# Altium schematic sheet 2_keys.SchDoc (part 2 of 2)
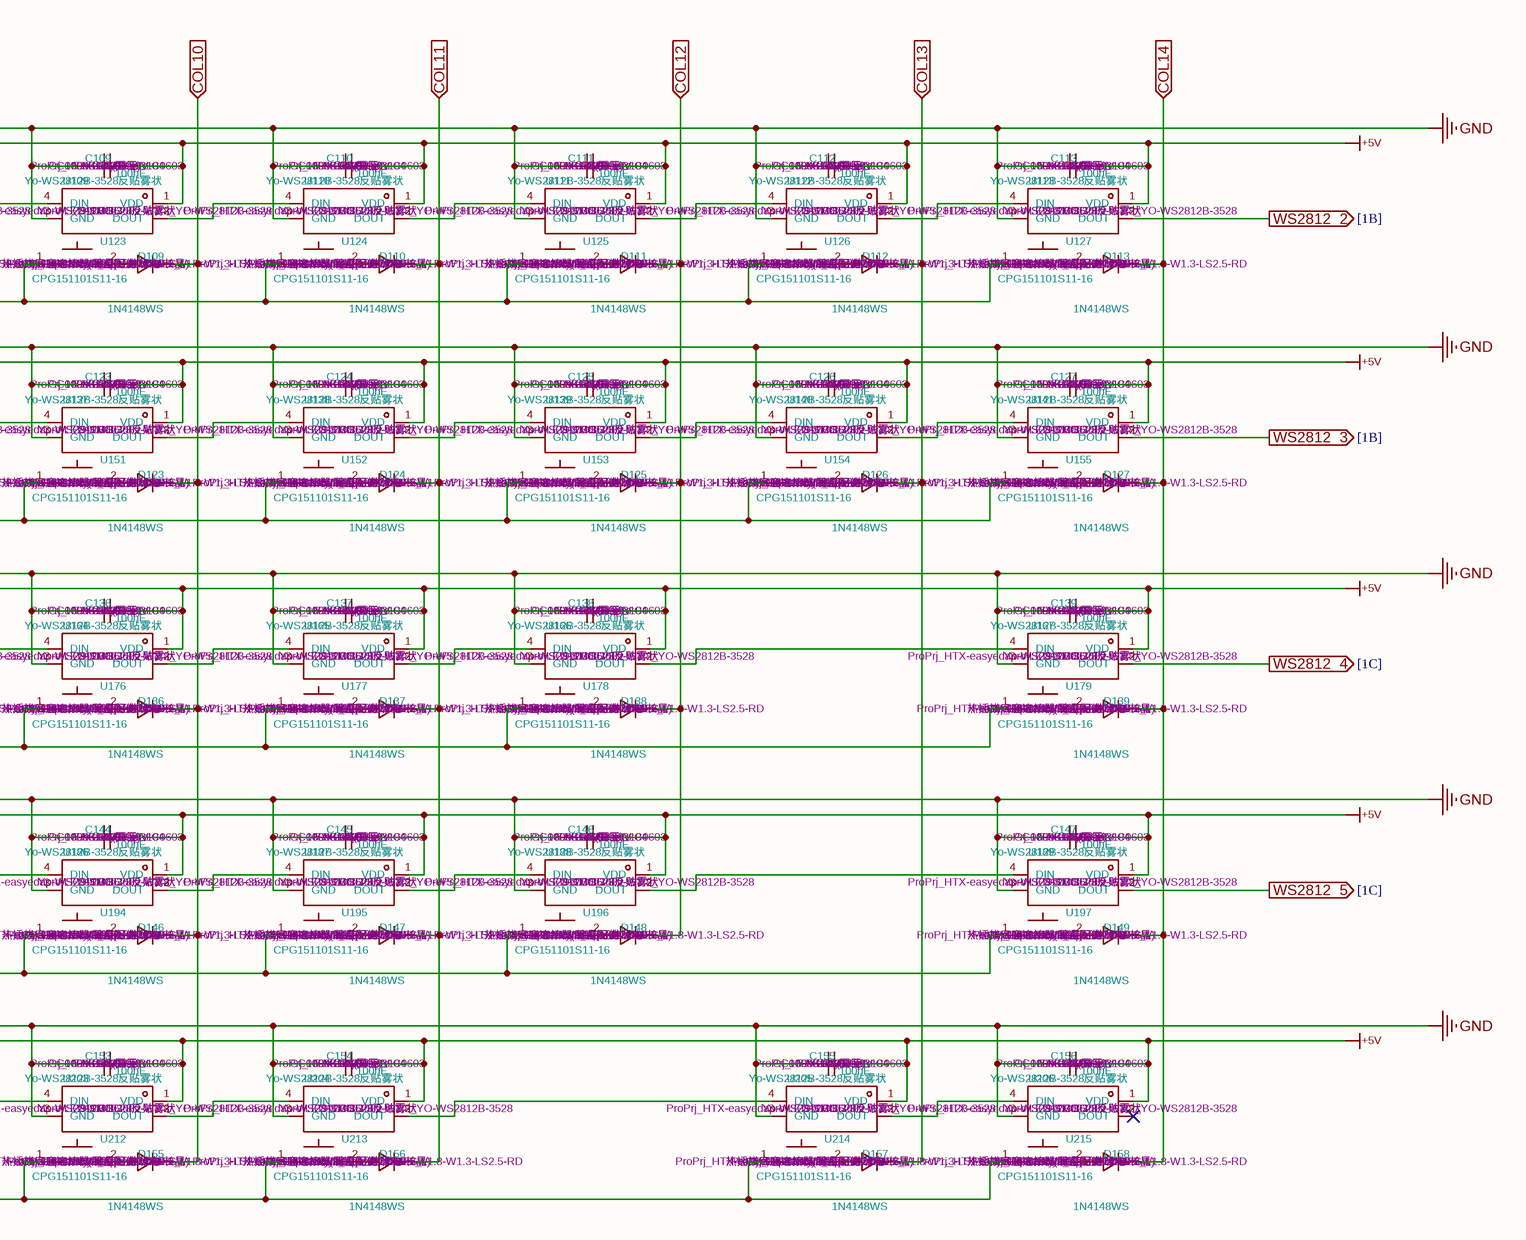
[diagram p3: 2_keys.SchDoc, right]

## Nets
+5V: C100.2 C101.2 C102.2 C103.2 C104.2 C105.2 C106.2 C107.2 C108.2 C109.2 C110.2 C111.2 C112.2 C113.2 C114.2 C115.2 C116.2 C117.2 C118.2 C119.2 C120.2 C121.2 C122.2 C123.2 C124.2 C125.2 C126.2 C127.2 C128.2 C129.2 C130.2 C131.2 C132.2 C133.2 C134.2 C135.2 C136.2 C137.2 C138.2 C139.2 C140.2 C141.2 C142.2 C143.2 C144.2 C145.2 C146.2 C147.2 C148.2 C149.2 C150.2 C151.2 C152.2 C153.2 C154.2 C155.2 C156.2 U100.1(VDD) U101.1(VDD) U102.1(VDD) U103.1(VDD) U104.1(VDD) U105.1(VDD) U106.1(VDD) U107.1(VDD) U108.1(VDD) U109.1(VDD) U110.1(VDD) U111.1(VDD) U112.1(VDD) U113.1(VDD) U128.1(VDD) U129.1(VDD) U130.1(VDD) U131.1(VDD) U132.1(VDD) U133.1(VDD) U134.1(VDD) U135.1(VDD) U136.1(VDD) U137.1(VDD) U138.1(VDD) U139.1(VDD) U140.1(VDD) U141.1(VDD) U156.1(VDD) U157.1(VDD) U158.1(VDD) U159.1(VDD) U160.1(VDD) U161.1(VDD) U162.1(VDD) U163.1(VDD) U164.1(VDD) U165.1(VDD) U166.1(VDD) U167.1(VDD) U180.3(VDD) U181.3(VDD) U182.1(VDD) U183.1(VDD) U184.1(VDD) U185.1(VDD) U186.1(VDD) U187.1(VDD) U188.1(VDD) U189.1(VDD) U198.1(VDD) U199.1(VDD) U200.1(VDD) U201.1(VDD) U202.1(VDD) U203.1(VDD) U204.1(VDD) U205.1(VDD) U206.1(VDD)
GND: C100.1 C101.1 C102.1 C103.1 C104.1 C105.1 C106.1 C107.1 C108.1 C109.1 C110.1 C111.1 C112.1 C113.1 C114.1 C115.1 C116.1 C117.1 C118.1 C119.1 C120.1 C121.1 C122.1 C123.1 C124.1 C125.1 C126.1 C127.1 C128.1 C129.1 C130.1 C131.1 C132.1 C133.1 C134.1 C135.1 C136.1 C137.1 C138.1 C139.1 C140.1 C141.1 C142.1 C143.1 C144.1 C145.1 C146.1 C147.1 C148.1 C149.1 C150.1 C151.1 C152.1 C153.1 C154.1 C155.1 C156.1 U100.3(GND) U101.3(GND) U102.3(GND) U103.3(GND) U104.3(GND) U105.3(GND) U106.3(GND) U107.3(GND) U108.3(GND) U109.3(GND) U110.3(GND) U111.3(GND) U112.3(GND) U113.3(GND) U128.3(GND) U129.3(GND) U130.3(GND) U131.3(GND) U132.3(GND) U133.3(GND) U134.3(GND) U135.3(GND) U136.3(GND) U137.3(GND) U138.3(GND) U139.3(GND) U140.3(GND) U141.3(GND) U156.3(GND) U157.3(GND) U158.3(GND) U159.3(GND) U160.3(GND) U161.3(GND) U162.3(GND) U163.3(GND) U164.3(GND) U165.3(GND) U166.3(GND) U167.3(GND) U180.1(GND) U181.1(GND) U182.3(GND) U183.3(GND) U184.3(GND) U185.3(GND) U186.3(GND) U187.3(GND) U188.3(GND) U189.3(GND) U198.3(GND) U199.3(GND) U200.3(GND) U201.3(GND) U202.3(GND) U203.3(GND) U204.3(GND) U205.3(GND) U206.3(GND)
COL1: D100.1(K) D114.1(K) D128.1(K) D140.1(C) D150.1(K) ; port COL1
COL2: D101.1(K) D115.1(K) D129.1(K) ; port COL2
COL3: D102.1(K) D116.1(K) D130.1(K) D141.1(C) D151.1(K) ; port COL3
COL4: D103.1(K) D117.1(K) D131.1(K) D142.1(K) D152.1(K) ; port COL4
COL5: D104.1(K) D118.1(K) ; port COL5
COL6: D105.1(K) D119.1(K) D132.1(K) D143.1(K) D153.1(K) ; port COL6
COL7: D106.1(K) D120.1(K) D133.1(K) D144.1(K) ; port COL7
COL8: D107.1(K) D121.1(K) D134.1(K) D145.1(K) D154.1(K) ; port COL8
COL9: D108.1(K) D122.1(K) D135.1(K) ; port COL9
COL10: D109.1(K) D123.1(K) D136.1(K) D146.1(K) D155.1(K) ; port COL10
COL11: D110.1(K) D124.1(K) D137.1(K) D147.1(K) D156.1(K) ; port COL11
COL12: D111.1(K) D125.1(K) D138.1(K) D148.1(K) ; port COL12
COL13: D112.1(K) D126.1(K) D157.1(K) ; port COL13
COL14: D113.1(K) D127.1(K) D139.1(K) D149.1(K) D158.1(K) ; port COL14
ROW1: U114.1 U115.1 U116.1 U117.1 U118.1 U119.1 U120.1 U121.1 U122.1 U123.1 U124.1 U125.1 U126.1 U127.1 ; port ROW1
ROW2: U142.1 U143.1 U144.1 U145.1 U146.1 U147.1 U148.1 U149.1 U150.1 U151.1 U152.1 U153.1 U154.1 U155.1 ; port ROW2
ROW3: U168.1 U169.1 U170.1 U171.1 U172.1 U173.1 U174.1 U175.1 U176.1 U177.1 U178.1 U179.1 ; port ROW3
ROW4: SW100.2(ON) SW101.2(ON) U190.1 U191.1 U192.1 U193.1 U194.1 U195.1 U196.1 U197.1 ; port ROW4
ROW5: U207.1 U208.1 U209.1 U210.1 U211.1 U212.1 U213.1 U214.1 U215.1 ; port ROW5
WS2812_1: U100.4(DIN) ; port WS2812_1
WS2812_2: U113.2(DOUT) U128.4(DIN) ; port WS2812_2
WS2812_3: U141.2(DOUT) U156.4(DIN) ; port WS2812_3
WS2812_4: U167.2(DOUT) U180.2(DI) ; port WS2812_4
WS2812_5: U189.2(DOUT) U198.4(DIN) ; port WS2812_5
NetD100_2: D100.2(A) U114.2
NetD101_2: D101.2(A) U115.2
NetD102_2: D102.2(A) U116.2
NetD103_2: D103.2(A) U117.2
NetD104_2: D104.2(A) U118.2
NetD105_2: D105.2(A) U119.2
NetD106_2: D106.2(A) U120.2
NetD107_2: D107.2(A) U121.2
NetD108_2: D108.2(A) U122.2
NetD109_2: D109.2(A) U123.2
NetD110_2: D110.2(A) U124.2
NetD111_2: D111.2(A) U125.2
NetD112_2: D112.2(A) U126.2
NetD113_2: D113.2(A) U127.2
NetD114_2: D114.2(A) U142.2
NetD115_2: D115.2(A) U143.2
NetD116_2: D116.2(A) U144.2
NetD117_2: D117.2(A) U145.2
NetD118_2: D118.2(A) U146.2
NetD119_2: D119.2(A) U147.2
NetD120_2: D120.2(A) U148.2
NetD121_2: D121.2(A) U149.2
NetD122_2: D122.2(A) U150.2
NetD123_2: D123.2(A) U151.2
NetD124_2: D124.2(A) U152.2
NetD125_2: D125.2(A) U153.2
NetD126_2: D126.2(A) U154.2
NetD127_2: D127.2(A) U155.2
NetD128_2: D128.2(A) U168.2
NetD129_2: D129.2(A) U169.2
NetD130_2: D130.2(A) U170.2
NetD131_2: D131.2(A) U171.2
NetD132_2: D132.2(A) U172.2
NetD133_2: D133.2(A) U173.2
NetD134_2: D134.2(A) U174.2
NetD135_2: D135.2(A) U175.2
NetD136_2: D136.2(A) U176.2
NetD137_2: D137.2(A) U177.2
NetD138_2: D138.2(A) U178.2
NetD139_2: D139.2(A) U179.2
NetD140_2: D140.2(A) SW100.3(NC)
NetD141_2: D141.2(A) SW101.3(NC)
NetD142_2: D142.2(A) U190.2
NetD143_2: D143.2(A) U191.2
NetD144_2: D144.2(A) U192.2
NetD145_2: D145.2(A) U193.2
NetD146_2: D146.2(A) U194.2
NetD147_2: D147.2(A) U195.2
NetD148_2: D148.2(A) U196.2
NetD149_2: D149.2(A) U197.2
NetD150_2: D150.2(A) U207.2
NetD151_2: D151.2(A) U208.2
NetD152_2: D152.2(A) U209.2
NetD153_2: D153.2(A) U210.2
NetD154_2: D154.2(A) U211.2
NetD155_2: D155.2(A) U212.2
NetD156_2: D156.2(A) U213.2
NetD157_2: D157.2(A) U214.2
NetD158_2: D158.2(A) U215.2
NetU100_2: U100.2(DOUT) U101.4(DIN)
NetU101_2: U101.2(DOUT) U102.4(DIN)
NetU102_2: U102.2(DOUT) U103.4(DIN)
NetU103_2: U103.2(DOUT) U104.4(DIN)
NetU104_2: U104.2(DOUT) U105.4(DIN)
NetU105_2: U105.2(DOUT) U106.4(DIN)
NetU106_2: U106.2(DOUT) U107.4(DIN)
NetU107_2: U107.2(DOUT) U108.4(DIN)
NetU108_2: U108.2(DOUT) U109.4(DIN)
NetU109_2: U109.2(DOUT) U110.4(DIN)
NetU110_2: U110.2(DOUT) U111.4(DIN)
NetU111_2: U111.2(DOUT) U112.4(DIN)
NetU112_2: U112.2(DOUT) U113.4(DIN)
NetU128_2: U128.2(DOUT) U129.4(DIN)
NetU129_2: U129.2(DOUT) U130.4(DIN)
NetU130_2: U130.2(DOUT) U131.4(DIN)
NetU131_2: U131.2(DOUT) U132.4(DIN)
NetU132_2: U132.2(DOUT) U133.4(DIN)
NetU133_2: U133.2(DOUT) U134.4(DIN)
NetU134_2: U134.2(DOUT) U135.4(DIN)
NetU135_2: U135.2(DOUT) U136.4(DIN)
NetU136_2: U136.2(DOUT) U137.4(DIN)
NetU137_2: U137.2(DOUT) U138.4(DIN)
NetU138_2: U138.2(DOUT) U139.4(DIN)
NetU139_2: U139.2(DOUT) U140.4(DIN)
NetU140_2: U140.2(DOUT) U141.4(DIN)
NetU156_2: U156.2(DOUT) U157.4(DIN)
NetU157_2: U157.2(DOUT) U158.4(DIN)
NetU158_2: U158.2(DOUT) U159.4(DIN)
NetU159_2: U159.2(DOUT) U160.4(DIN)
NetU160_2: U160.2(DOUT) U161.4(DIN)
NetU161_2: U161.2(DOUT) U162.4(DIN)
NetU162_2: U162.2(DOUT) U163.4(DIN)
NetU163_2: U163.2(DOUT) U164.4(DIN)
NetU164_2: U164.2(DOUT) U165.4(DIN)
NetU165_2: U165.2(DOUT) U166.4(DIN)
NetU166_2: U166.2(DOUT) U167.4(DIN)
NetU180_4: U180.4(DO) U181.2(DI)
NetU181_4: U181.4(DO) U182.4(DIN)
NetU182_2: U182.2(DOUT) U183.4(DIN)
NetU183_2: U183.2(DOUT) U184.4(DIN)
NetU184_2: U184.2(DOUT) U185.4(DIN)
NetU185_2: U185.2(DOUT) U186.4(DIN)
NetU186_2: U186.2(DOUT) U187.4(DIN)
NetU187_2: U187.2(DOUT) U188.4(DIN)
NetU188_2: U188.2(DOUT) U189.4(DIN)
NetU198_2: U198.2(DOUT) U199.4(DIN)
NetU199_2: U199.2(DOUT) U200.4(DIN)
NetU200_2: U200.2(DOUT) U201.4(DIN)
NetU201_2: U201.2(DOUT) U202.4(DIN)
NetU202_2: U202.2(DOUT) U203.4(DIN)
NetU203_2: U203.2(DOUT) U204.4(DIN)
NetU204_2: U204.2(DOUT) U205.4(DIN)
NetU205_2: U205.2(DOUT) U206.4(DIN)

Not connected (* = marked no-connect by the designer): SW100 1(C)*; SW101 1(C)*; U206 2(DOUT)*

## Notes on the sheet
- 1
- 2
- 3
- 4
- 5
- 6
- 7
- 8
- 9
- 10
- 11
- 12
- 13
- 14
- 15
- 16
- A
- B
- C
- D
- E
- F
- G
- H
- I
- J
- K
- Title:
- File: 2_keys.kicad_sch
- Sheet: /
- KiCad E.D.A.  kicad (5.1.4)-1
- Size: A1
- Date:
- Rev:
- Id: 1/1

## Library data of the parts
C100-C156 = CC0603KRX7R9BB104: Manufacturer Part: CC0603KRX7R9BB104; Value: 100nF
D100-D139 D142-D158 = 1N4148WS T4: Manufacturer Part: 1N4148WS; Value: 1N4148WS
D140 D141 = 1N4148WS_C437156: Manufacturer Part: 1N4148WS; Value: 1N4148WS
U100-U113 U128-U141 U156-U167 U182-U189 U198-U206 = YO-WS2812B-3528_C9900003682: Manufacturer Part: Yo-WS2812B-3528反贴雾状; LCSC Part Name: Yo-WS2812B-3528反贴雾状; Value: Yo-WS2812B-3528反贴雾状
U114-U127 U142-U155 U168-U179 U190-U197 U207-U215 = CPG151101S11-16_C41430893: Manufacturer Part: CPG151101S11-16; Value: CPG151101S11-16
SW100 SW101 = K9-1267T: Manufacturer Part: K9-1267T; Value: K9-1267T
U180 U181 = XL-3528RGBC-WS2812B: Manufacturer Part: XL-3528RGBC-WS2812B; LCSC Part Name: XL-3528RGBC-WS2812B; Value: XL-3528RGBC-WS2812B